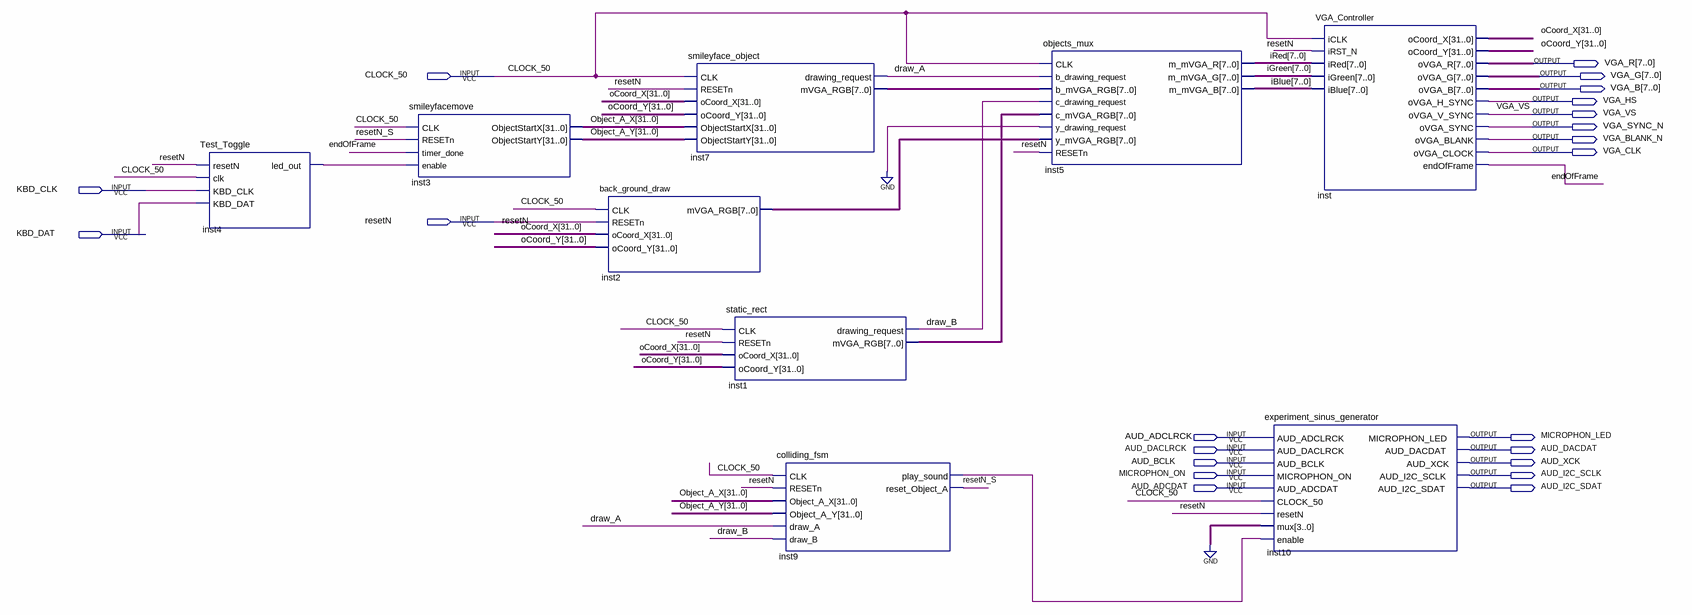
[diagram p0: schematic sheet]
// Quartus schematic TOP.1.bdf as structural Verilog: 9 symbols, 22 pins
module \TOP.1  (
  input  CLOCK_50,
  input  KBD_CLK,
  input  resetN,
  input  KBD_DAT,
  input  AUD_ADCLRCK,
  input  AUD_DACLRCK,
  input  AUD_BCLK,
  input  MICROPHON_ON,
  input  AUD_ADCDAT,
  output [7:0] VGA_R,
  output [7:0] VGA_G,
  output [7:0] VGA_B,
  output VGA_HS,
  output VGA_VS,
  output VGA_SYNC_N,
  output VGA_BLANK_N,
  output VGA_CLK,
  output MICROPHON_LED,
  output AUD_DACDAT,
  output AUD_XCK,
  output AUD_I2C_SCLK,
  output AUD_I2C_SDAT
);

  wire draw_A, draw_B, endOfFrame, inst4_led_out, inst9_play_sound, resetN_S;
  wire [7:0] iBlue, iGreen, inst1_mvga_rgb, inst2_mvga_rgb, inst7_mvga_rgb, iRed;
  wire [31:0] Object_A_X, Object_A_Y, oCoord_X, oCoord_Y;

  Test_Toggle inst4 (.resetN(resetN), .clk(CLOCK_50), .KBD_CLK(KBD_CLK), .KBD_DAT(KBD_DAT), .led_out(inst4_led_out));
  smileyfacemove inst3 (
    .CLK(CLOCK_50), .RESETn(resetN_S), .timer_done(endOfFrame), .enable(inst4_led_out),
    .ObjectStartX(Object_A_X), .ObjectStartY(Object_A_Y));
  back_ground_draw inst2 (
    .CLK(CLOCK_50), .RESETn(resetN), .oCoord_X(oCoord_X), .oCoord_Y(oCoord_Y), .mVGA_RGB(inst2_mvga_rgb));
  smileyface_object inst7 (
    .CLK(CLOCK_50), .RESETn(resetN), .oCoord_X(oCoord_X), .oCoord_Y(oCoord_Y), .ObjectStartX(Object_A_X),
    .ObjectStartY(Object_A_Y), .drawing_request(draw_A), .mVGA_RGB(inst7_mvga_rgb));
  static_rect inst1 (
    .CLK(CLOCK_50), .RESETn(resetN), .oCoord_X(oCoord_X), .oCoord_Y(oCoord_Y), .drawing_request(draw_B),
    .mVGA_RGB(inst1_mvga_rgb));
  colliding_fsm inst9 (
    .CLK(CLOCK_50), .RESETn(resetN), .Object_A_X(Object_A_X), .Object_A_Y(Object_A_Y), .draw_A(draw_A),
    .draw_B(draw_B), .play_sound(inst9_play_sound), .reset_Object_A(resetN_S));
  objects_mux inst5 (
    .CLK(CLOCK_50), .b_drawing_request(draw_A), .b_mVGA_RGB(inst7_mvga_rgb), .c_drawing_request(draw_B),
    .c_mVGA_RGB(inst1_mvga_rgb), .y_drawing_request(1'b0), .y_mVGA_RGB(inst2_mvga_rgb), .RESETn(resetN),
    .m_mVGA_R(iRed), .m_mVGA_G(iGreen), .m_mVGA_B(iBlue));
  experiment_sinus_generator inst10 (
    .AUD_ADCLRCK(AUD_ADCLRCK), .AUD_DACLRCK(AUD_DACLRCK), .AUD_BCLK(AUD_BCLK), .MICROPHON_ON(MICROPHON_ON),
    .AUD_ADCDAT(AUD_ADCDAT), .CLOCK_50(CLOCK_50), .resetN(resetN), .mux(4'b0000), .enable(inst9_play_sound),
    .MICROPHON_LED(MICROPHON_LED), .AUD_DACDAT(AUD_DACDAT), .AUD_XCK(AUD_XCK), .AUD_I2C_SCLK(AUD_I2C_SCLK),
    .AUD_I2C_SDAT(AUD_I2C_SDAT));
  VGA_Controller inst (
    .iCLK(CLOCK_50), .iRST_N(resetN), .iRed(iRed), .iGreen(iGreen), .iBlue(iBlue), .oCoord_X(oCoord_X),
    .oCoord_Y(oCoord_Y), .oVGA_R(VGA_R), .oVGA_G(VGA_G), .oVGA_B(VGA_B), .oVGA_H_SYNC(VGA_HS),
    .oVGA_V_SYNC(VGA_VS), .oVGA_SYNC(VGA_SYNC_N), .oVGA_BLANK(VGA_BLANK_N), .oVGA_CLOCK(VGA_CLK),
    .endOfFrame(endOfFrame));
endmodule
